# Altium schematic sheet schematic.SchDoc
size 594 x 420 mm; Address1: Address1; Address2: Address2; Address3: Address3; Address4: Address4; SheetNumber: 1; Scale: 1:1
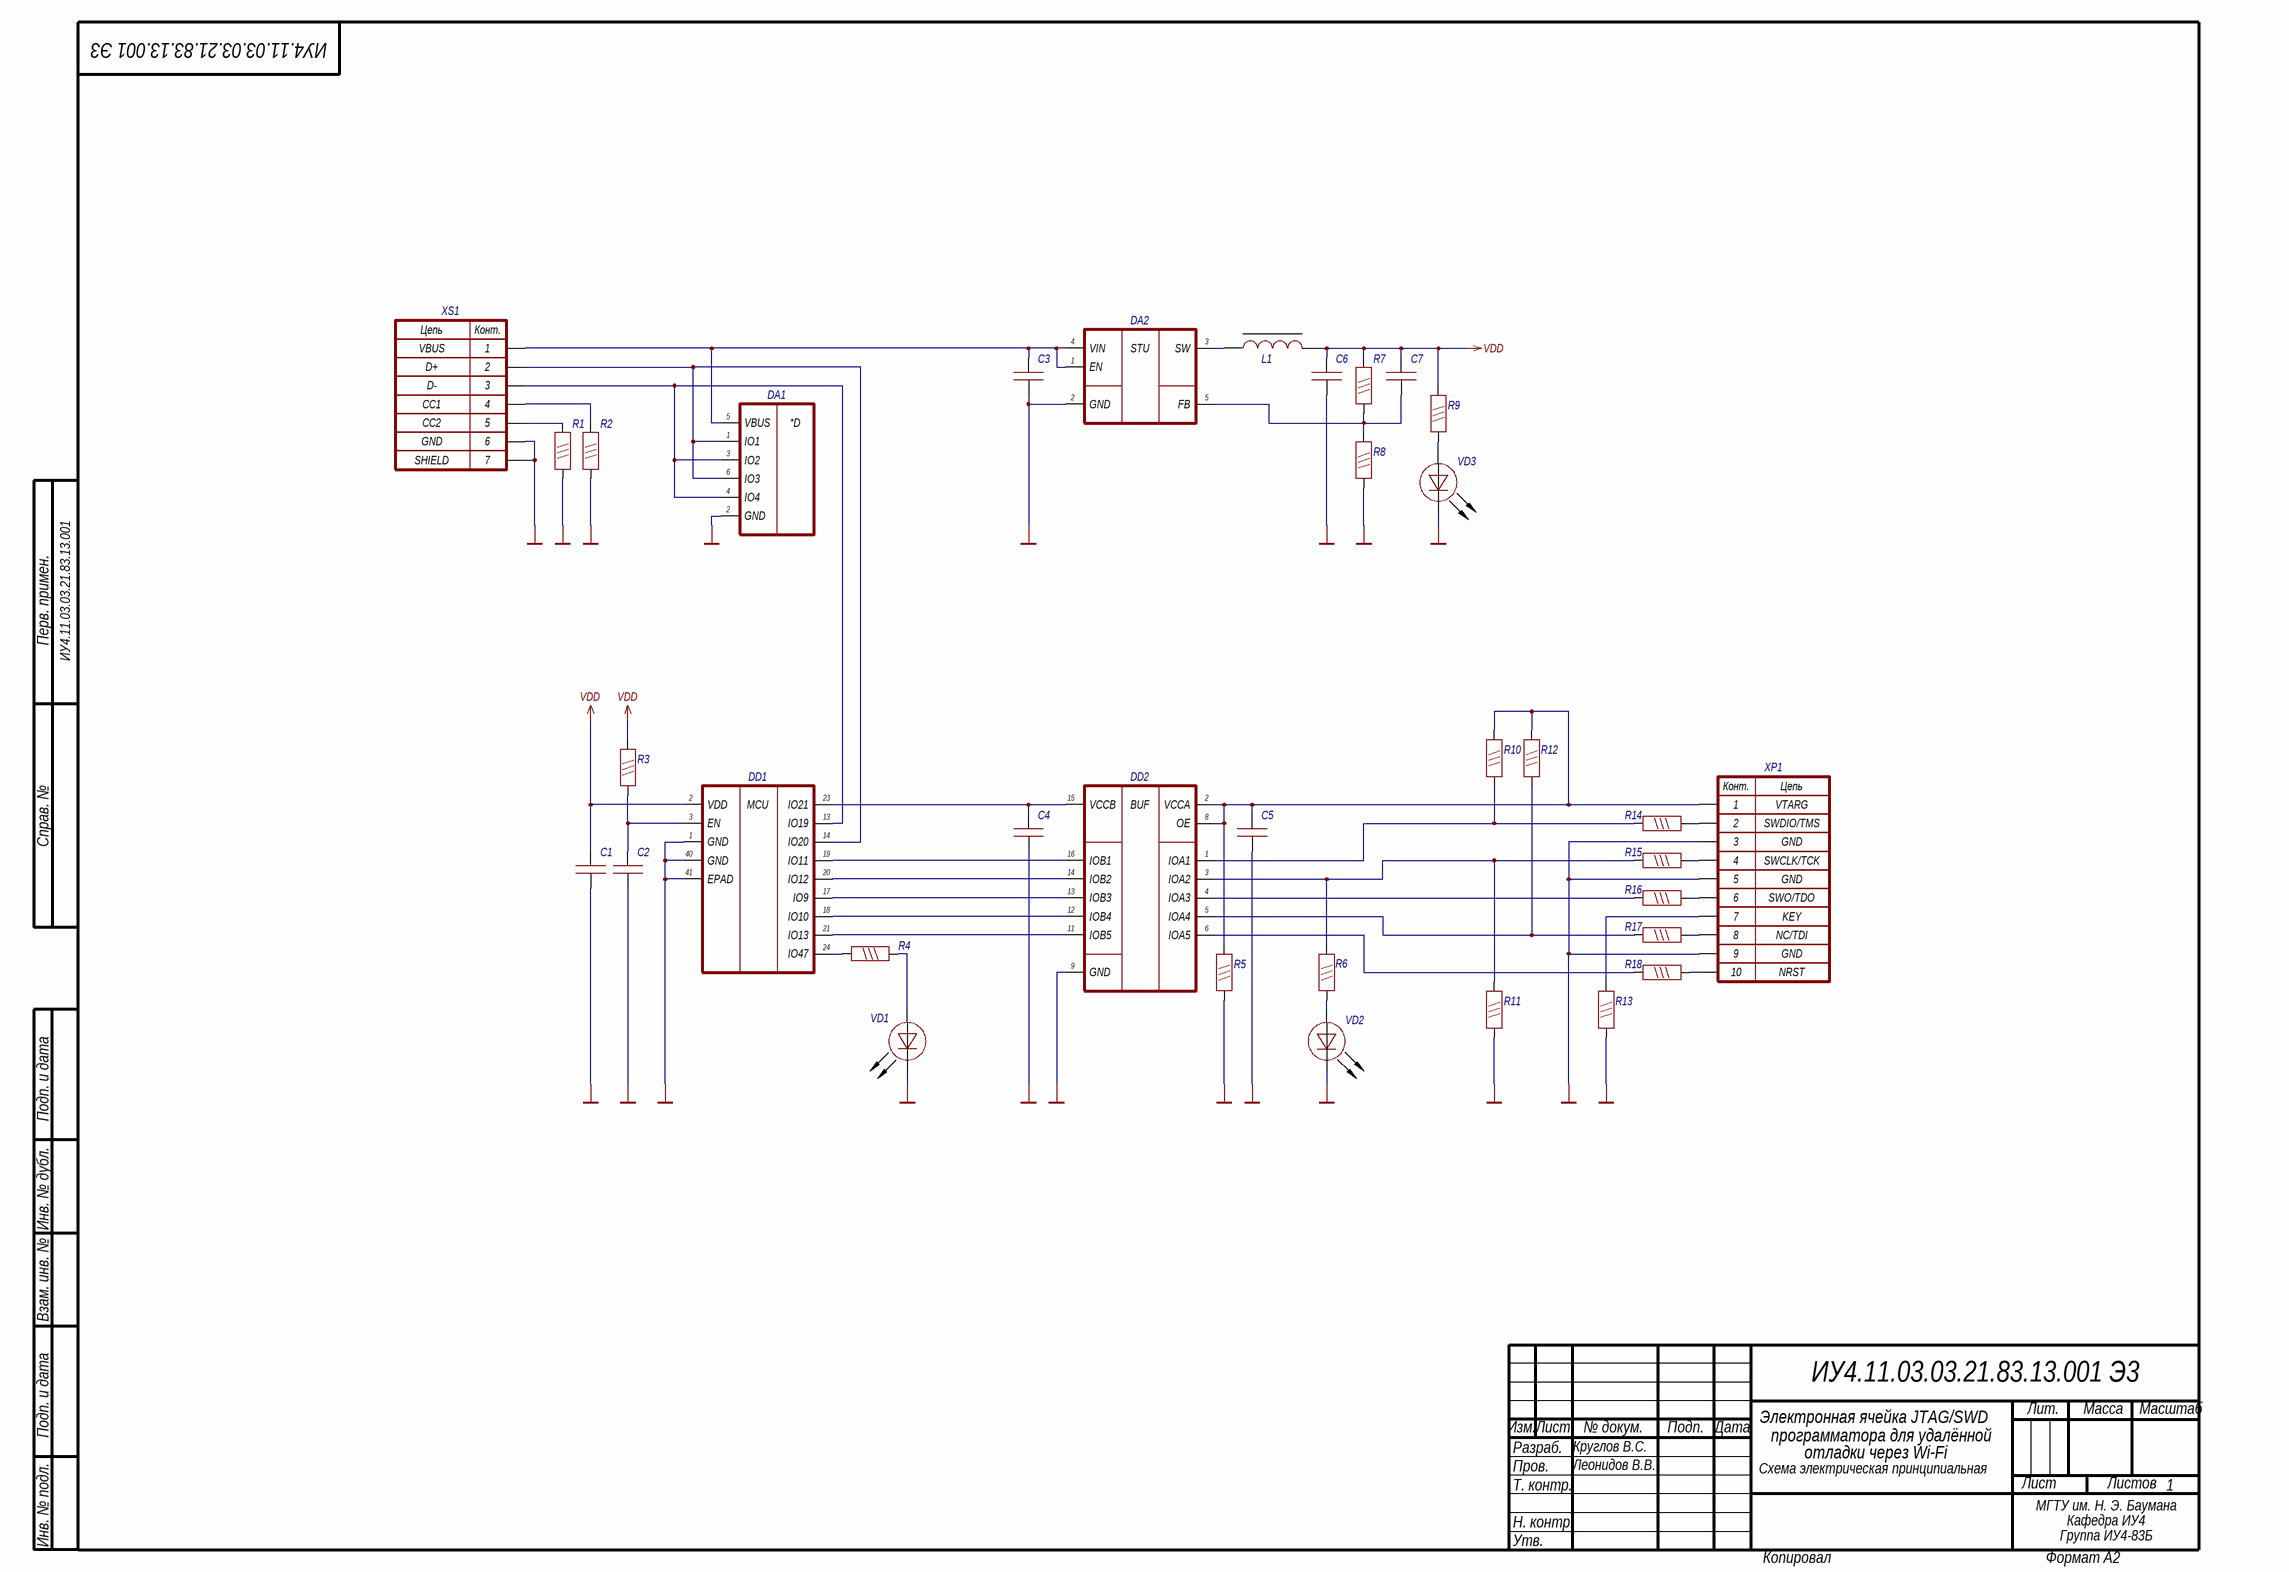
[diagram p0: schematic.SchDoc]

## Parts
C1  04023J0R9BBWTR  [CAP: 0603]  (value not drawn)
C2  04023J0R9BBWTR  [CAP: 0603]  (value not drawn)
C3  04023J0R9BBWTR  [CAP: 0603]  (value not drawn)
C4  04023J0R9BBWTR  [CAP: 0603]  (value not drawn)
C5  04023J0R9BBWTR  [CAP: 0603]  (value not drawn)
C6  04023J0R9BBWTR  [CAP: 0603]  (value not drawn)
C7  04023J0R9BBWTR  [CAP: 0603]  (value not drawn)
DA1  SRV05-4.TCT  [SOT23-6]  (value not drawn)
DA2  TLV62569DBVR  [SOT23-5]  (value not drawn)
DD1  ESP32-WROOM-32U (16MB)  [XCVR_ESP32S3WROOM1N8R8]  (value not drawn)
DD2  TXB0106PWR  [16-SSOP]  (value not drawn)
L1  IHLP2020CZER2R2M01  [FP-IHLP-2020CZ-FP_1_905x2-MFG]  (value not drawn)
R1  RC0402FR-074K7L  [RES: 0603]  (value not drawn)
R2  RC0402FR-074K7L  [RES: 0603]  (value not drawn)
R3  RC0402FR-074K7L  [RES: 0603]  (value not drawn)
R4  RC0402FR-074K7L  [RES: 0603]  (value not drawn)
R5  RC0402FR-074K7L  [RES: 0603]  (value not drawn)
R6  RC0402FR-074K7L  [RES: 0603]  (value not drawn)
R7  RC0402FR-074K7L  [RES: 0603]  (value not drawn)
R8  RC0402FR-074K7L  [RES: 0603]  (value not drawn)
R9  RC0402FR-074K7L  [RES: 0603]  (value not drawn)
R10  RC0402FR-074K7L  [RES: 0603]  (value not drawn)
R11  RC0402FR-074K7L  [RES: 0603]  (value not drawn)
R12  RC0402FR-074K7L  [RES: 0603]  (value not drawn)
R13  RC0402FR-074K7L  [RES: 0603]  (value not drawn)
R14  RC0402FR-074K7L  [RES: 0603]  (value not drawn)
R15  RC0402FR-074K7L  [RES: 0603]  (value not drawn)
R16  RC0402FR-074K7L  [RES: 0603]  (value not drawn)
R17  RC0402FR-074K7L  [RES: 0603]  (value not drawn)
R18  RC0402FR-074K7L  [RES: 0603]  (value not drawn)
VD1  (no value)  [LED: 0603G]
VD2  (no value)  [LED: 0603B]
VD3  (no value)  [LED: 0603R]
XP1  TST  [FP-TSM-105-01-F-DV-MFG]  (value not drawn)
XS1  12401610E4#2A  [FP-USB4110-GF-A-MFG]  (value not drawn)

## Nets
GND: C1.1 C2.1 C3.1 C4.1 C5.1 C6.1 DA1.2(GND) DA2.2(GND) DD1.1(GND) DD1.40(GND) DD1.41(EPAD) DD2.9(GND) R1.2 R2.2 R5.2 R8.2 R11.1 R13.2 VD1.2(C) VD2.2(C) VD3.2(C) XP1.3 XP1.5 XP1.9 XS1.GND XS1.SHLD
VDD: C1.2 C6.2 C7.2 DD1.2(VDD) L1.2 R3.2 R7.1 R9.2
NetC2_2: C2.2 DD1.3(EN) R3.1
NetC3_2: C3.2 DA1.5(VBUS) DA2.1(EN) DA2.4(VIN) XS1.VBUS
NetC4_2: C4.2 DD1.23(IO21) DD2.15(VCCB)
NetC5_2: C5.2 DD2.2(VCCA) DD2.8(OE) R5.1 R10.1 R12.1 XP1.1
NetC7_1: C7.1 DA2.5(FB) R7.2 R8.1
NetDA1_1: DA1.1(IO1) DA1.6(IO3) DD1.14(IO20) XS1.D+
NetDA1_3: DA1.3(IO2) DA1.4(IO4) DD1.13(IO19) XS1.D-
NetDA2_3: DA2.3(SW) L1.1
NetDD1_17: DD1.17(IO9) DD2.13(IOB3)
NetDD1_18: DD1.18(IO10) DD2.12(IOB4)
NetDD1_19: DD1.19(IO11) DD2.16(IOB1)
NetDD1_20: DD1.20(IO12) DD2.14(IOB2)
NetDD1_21: DD1.21(IO13) DD2.11(IOB5)
NetDD1_24: DD1.24(IO47) R4.2
NetDD2_1: DD2.1(IOA1) R10.2 R14.2
NetDD2_3: DD2.3(IOA2) R6.2 R11.2 R15.2
NetDD2_4: DD2.4(IOA3) R16.2
NetDD2_5: DD2.5(IOA4) R12.2 R17.2
NetDD2_6: DD2.6(IOA5) R18.2
NetR1_1: R1.1 XS1.CC2(SHLD)
NetR2_1: R2.1 XS1.CC1(GND)
NetR4_1: R4.1 VD1.1(A)
NetR6_1: R6.1 VD2.1(A)
NetR9_1: R9.1 VD3.1(A)
NetR13_1: R13.1 XP1.7
NetR14_1: R14.1 XP1.2
NetR15_1: R15.1 XP1.4
NetR16_1: R16.1 XP1.6
NetR17_1: R17.1 XP1.8
NetR18_1: R18.1 XP1.10

## Notes on the sheet
- ИУ4.11.03.03.21.83.13.001 Э3
- ИУ4.11.03.03.21.83.13.001
- Электронная ячейка JTAG/SWD
- программатора для удалённой
- Круглов В.С.
- Леонидов В.В.
- Схема электрическая принципиальная
- отладки через Wi-Fi
- МГТУ им. Н. Э. Баумана
- Кафедра ИУ4
- Группа ИУ4-83Б
- Перв. примен.
- Справ. №
- Подп. и дата
- Инв. № дубл.
- Взам. инв. №
- Разраб.
- Изм.
- Лист
- № докум.
- Подп.
- Дата
- Лит.
- Масса
- Масштаб
- Пров.
- Т. контр.
- Листов
- 1
- Инв. № подл.
- Н. контр.
- Утв.
- Копировал
- Формат А2
- (in symbol ESP32-S3) MCU
- (in symbol SRV05-4.TCT) *D
- (in symbol STU_SW) STU
- (in symbol TST-10) Конт.; Цепь; VTARG; SWDIO/TMS; GND; SWCLK/TCK; SWO/TDO; KEY; NC/TDI; NRST
- (in symbol TXB0106PWR) BUF
- (in symbol USB-C) Цепь; Конт.; 1; 2; 3; 4; 5; 6; SHIELD; 7

## Library data of the parts
C1-C7 = C: Manufacturer: AVX Interconnect / Elco; Part Number: 04023J0R9BBWTR
DA1 = SRV05-4.TCT: RailClamp(R) Low Capacitance TVS Diode Array, 5 pF, 17.5 VC, -55 to 125 degC, 6-Pin SOT23, RoHS, Tape and Reel; Manufacturer: Semtech; Leakage Current (Max): 5uA; Polarity: Uni-Directional; Peak Pulse Power Dissipation: 300W; Clamping Voltage: 17.5V; Number of Elements: 1; Working Voltage: 5V; Test Current (It): 1mA; Configuration: Quad; Reverse Breakdown Voltage: 6V; Suppressor Type: DiodeArrays; Peak Pulse Current: 12A; Product Depth (mm): 1.6mm; Product Height (mm): 1.15mm; Clamping Voltage (Max): 12.5V; Rad Hardened: No; Product Length (mm): 2.9mm; Capacitance Value: 5pF; Mounting: SurfaceMount; Datasheet URL: https://datasheet.ciiva.com/8029/srv05-4-8029973.pdf; Datasheet Version: Jan-08; Packaging: TapeandReel; Package / Case: SOT-23; Operating Temp Range: -55Cto125C; Pin Count: 6; Direction Type: Uni-Directional; Operating Temperature Min Deg. C: -55C; Reverse Stand-off Voltage: 5V; Leakage Current: 5uA; Manufacturer URL: http://www.semtech.com/; Working Voltage (Max): 5V; Package Reference: SOT23-6; Package Description: 6-Pin Small Outline Transistor, Body 2.9 x 1.6 mm, Pitch 0.95 mm; Operating Temperature Max Deg. C: 125C; Operating Temperature Classification: Military; Mounting Style: SurfaceMount
DA2 = STU_SW: IC REG BUCK ADJ 2A SOT23-5; Output Configuration: Positive; Min Output Voltage: 600mV; Max Output Voltage: 5.5V; Switching Frequency: 1.5MHz; Output Type: Adjustable; Synchronous Rectifier: Yes; Min Input Voltage: 2.5V; Output Current: 2A; Mount: Surface Mount; Min Operating Temperature: -40°C; Max Operating Temperature: 125°C; RoHS Compliant: Yes; Max Input Voltage: 5.5V; Case/Package: SOT-23-5; Packaging: Cut Tape
DD1 = ESP32-S3: RX TXRX MODULE WIFI U.FL SMD; Sensitivity: -98dBm; Frequency: 2.5GHz; Memory Size: 536KB; Data Rate: 150Mbps; Interface: I2C; Packaging: Tape and Reel; Case/Package: SMD/SMT; Max Operating Temperature: 85°C; Mount: Surface Mount; Min Operating Temperature: -40°C
DD2 = TXB0106PWR: Manufacturer Lifecycle Status: ACTIVE; NexarPartId: 9437508; Quiescent Current: 3.5µA; Number of Channels: 6; Data Rate: 100Mbps; Max Supply Voltage: 5.5V; Logic Function: Translator; Number of Circuits: 1; Min Supply Voltage (DC): 1.2V; Low Level Output Current: 20µA; Max Junction Temperature (Tj): 150°C; High Level Output Current: -20µA; Propagation Delay: 4ns; Turn-On Delay Time: 9.5ns; Termination: SMD/SMT; Lead Free: Lead Free; Packaging: Cut Tape (CT); Length: 5mm; Mount: Surface Mount; Number of Pins: 16; Number of Inputs: 6; Weight: 61.887009mg; Number of Transceivers: 6; Radiation Hardening: No; Number of Outputs: 6; Max Operating Temperature: 85°C; RoHS: Compliant; Height: 1.2mm; Number of Bits: 6; Ambient Temperature Range High: 85°C; REACH SVHC: No SVHC; Min Supply Voltage: 1.2V; Output Current: 20µA; Case/Package: TSSOP; Lifecycle Status: Production; Width: 4.4mm; Thickness: 1mm; Schedule B: 8542390000, 8542390000; Contact Plating: Gold; Min Operating Temperature: -40°C
L1 = L: Fixed Inductors Commercial High Saturation Series 2.2uH 5.8A 29.2mΩ 20%; DC Resistance (DCR): 29.2mR; Test Frequency: 100kHz; Core Material: Metal; Self Resonant Frequency: 39MHz; Shielding: Shielded; Max DC Current: 10A; Radiation Hardening: No; Height: 3mm; Tolerance: 20%; Package Quantity: 2000; Weight: 0.007055oz; Contact Plating: Tin; Termination: SMD/SMT; Height - Seated (Max): 0.118inch; Inductance Tolerance: 20%; RMS Current (Irms): 5.8A; Lead Free: Lead Free; Width: 0.204inch; Min Operating Temperature: -55°C; Length: 5.74mm; Max Operating Temperature: 125°C; Saturation Current: 10A; Inductance: 2.2uH; Depth: 5.43mm; Current Rating: 5.8A; Case/Package: 2020; Mount: Surface Mount; Packaging: Tape and Reel; Military Standard: Not
R1-R18 = R: Manufacturer: Yageo / Phycomp; Part Number: RC0402FR-074K7L
VD1 = LED: FYLS-0603UGC; ValueManufacturerPartNumber: LED, Green, *, *, *, -55...+150°C; ColorParameter: Green; Manufacturer: *; Package: *; HelpURL: *; Temperature: -55...+150°C; TypeDiode: LED; Current: *; VoltageDrop: *; PartNumber: *; Color: GREEN
VD2 = LED: FYLS-0603UBC; ValueManufacturerPartNumber: LED, Green, *, *, *, -55...+150°C; ColorParameter: Green; Manufacturer: *; Package: *; HelpURL: *; Temperature: -55...+150°C; TypeDiode: LED; Current: *; VoltageDrop: *; PartNumber: *; Color: GREEN
VD3 = LED: ValueManufacturerPartNumber: LED, Green, *, *, *, -55...+150°C; ColorParameter: Green; Manufacturer: *; Package: *; HelpURL: *; Temperature: -55...+150°C; TypeDiode: LED; Current: *; VoltageDrop: *; PartNumber: *; Color: GREEN
XP1 = TST-10
XS1 = USB-C: CONN RCP USB3.1 TYPEC 24P SMD RA; Connector Type: USB; Number of Contacts: 24; Gender: Receptacle; Packaging: Cut Tape; Mount: Surface Mount; Number of Pins: 24